# Altium schematic sheet QSPI_EMMC_MICROSD.SchDoc
size A3
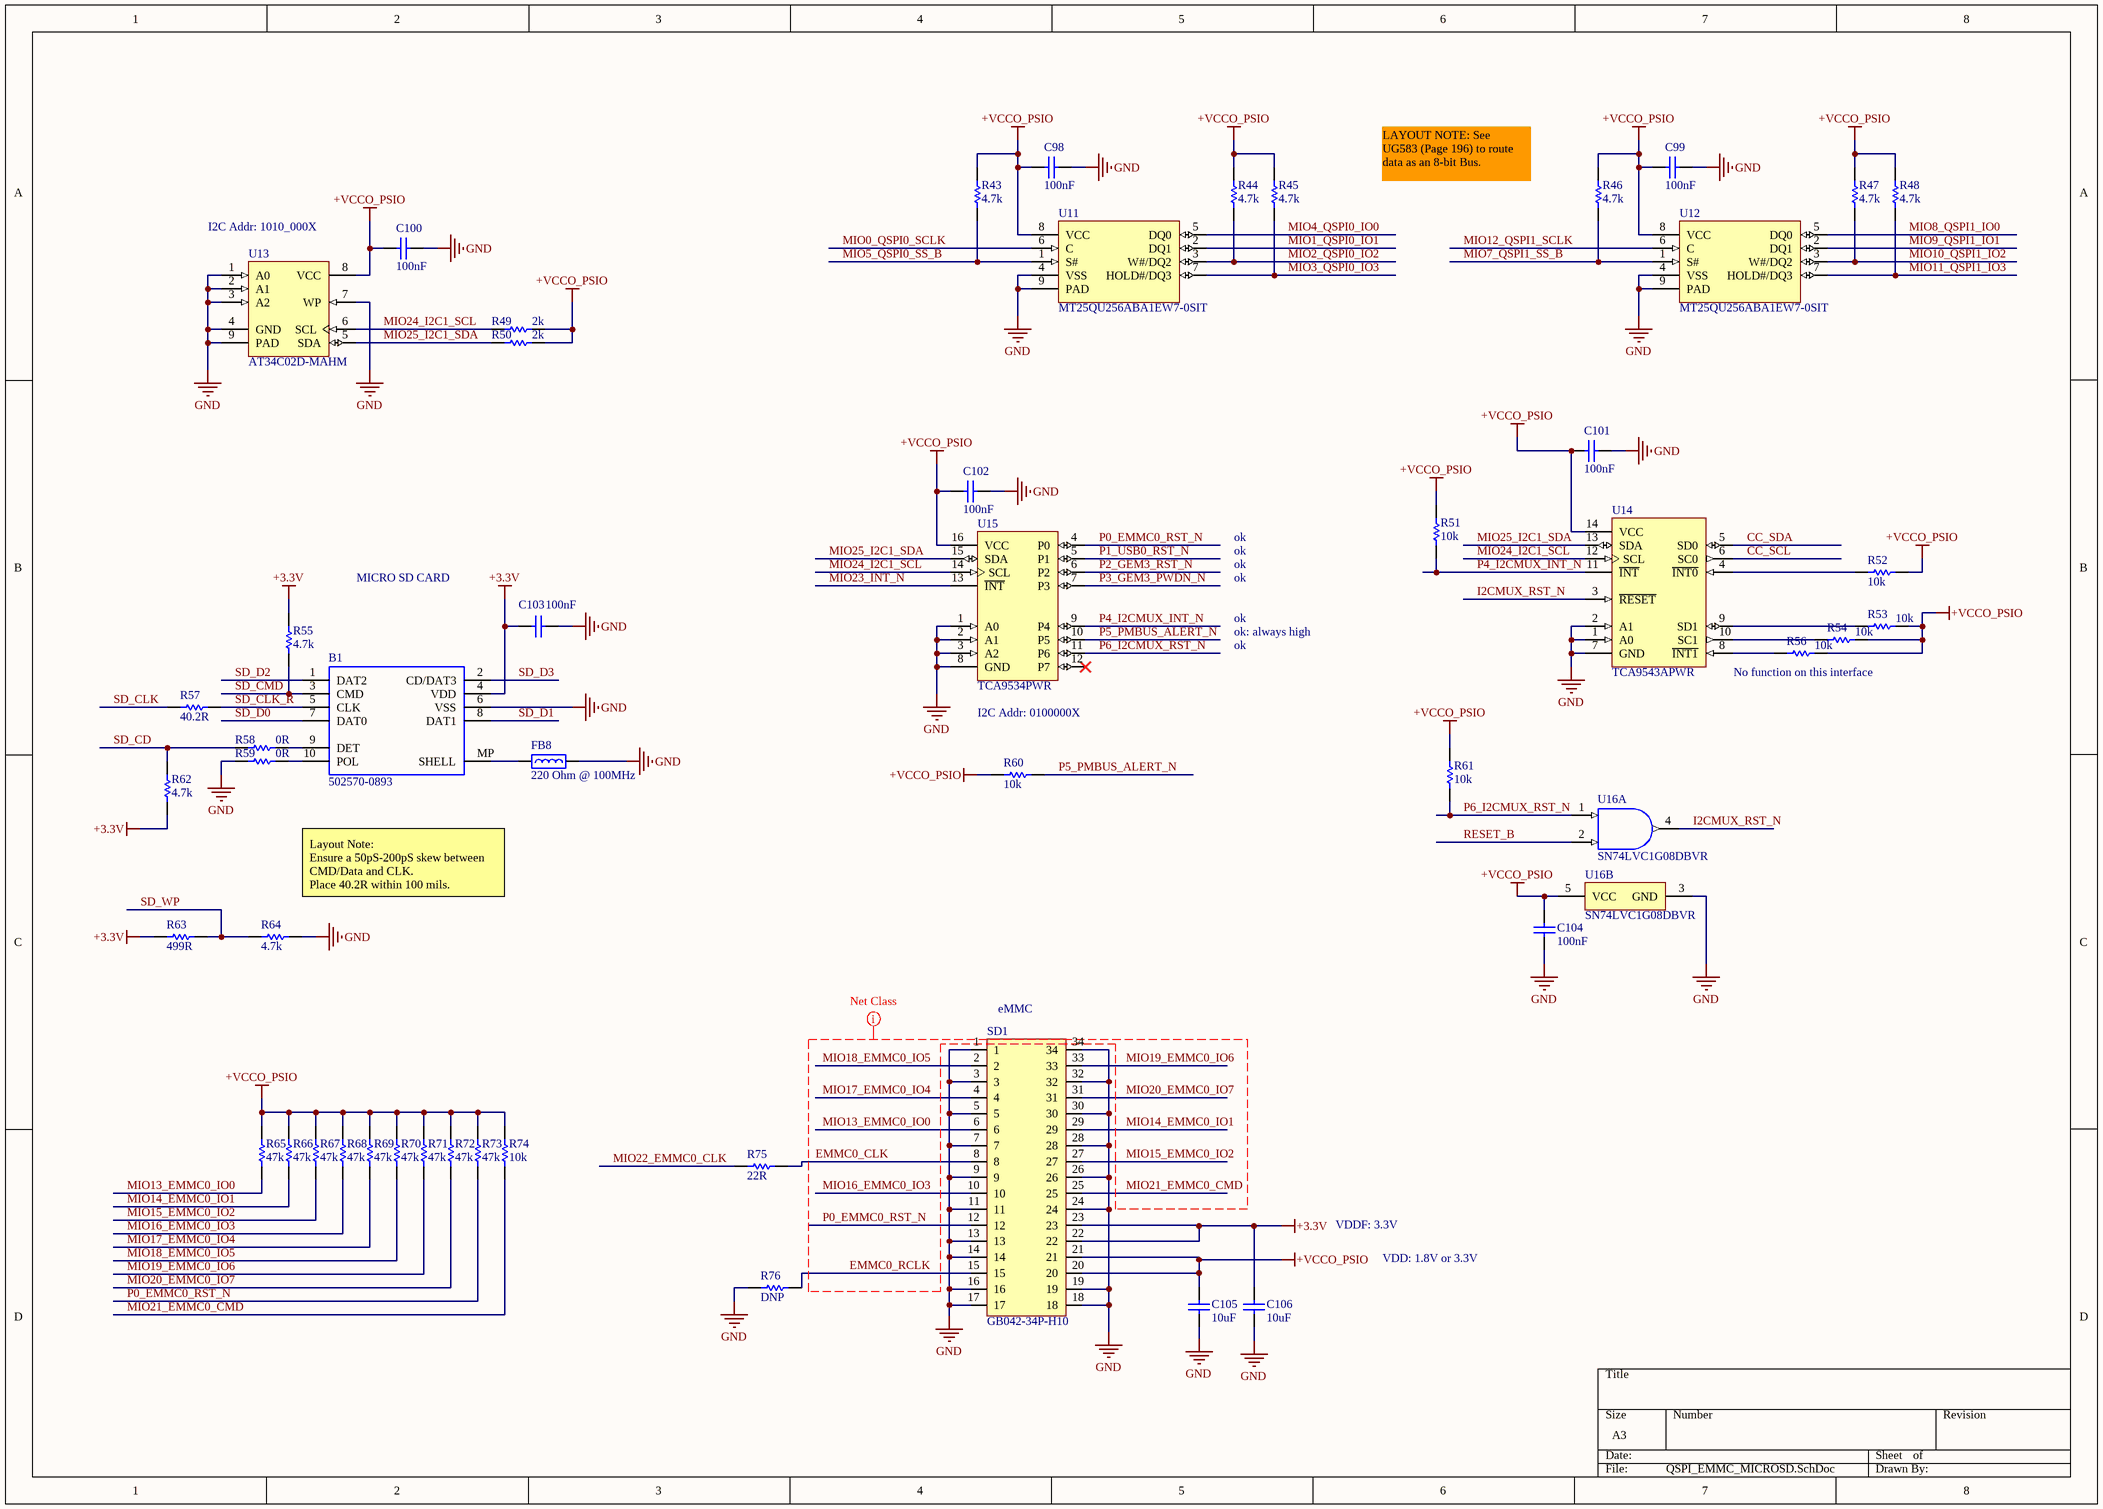
[diagram p0: QSPI_EMMC_MICROSD.SchDoc]

## Parts
B1  502570-0893  [502570-0893_1]
C98  100nF  [CAPC1005L_0402]
C99  100nF  [CAPC1005L_0402]
C100  100nF  [CAPC1005L_0402]
C101  100nF  [CAPC1005L_0402]
C102  100nF  [CAPC1005L_0402]
C103  100nF  [CAPC1005L_0402]
C104  100nF  [CAPC1005L_0402]
C105  10uF  [CAPC1005L_0402]
C106  10uF  [CAPC1005L_0402]
FB8  Impedance @ Frequency: 220 Ohm @ 100MHz  [INDC1608N_0603]  (hidden comment: BEAD0603_220_2A5_40M)
R43  value 4.7k  [RESC1005L_0402]  (hidden comment: RES0402_4K7_0W1_1T)
R44  value 4.7k  [RESC1005L_0402]  (hidden comment: RES0402_4K7_0W1_1T)
R45  value 4.7k  [RESC1005L_0402]  (hidden comment: RES0402_4K7_0W1_1T)
R46  value 4.7k  [RESC1005L_0402]  (hidden comment: RES0402_4K7_0W1_1T)
R47  value 4.7k  [RESC1005L_0402]  (hidden comment: RES0402_4K7_0W1_1T)
R48  value 4.7k  [RESC1005L_0402]  (hidden comment: RES0402_4K7_0W1_1T)
R49  value 2k  [RESC1005L_0402]  (hidden comment: RES0402_2K_0W1_1T)
R50  value 2k  [RESC1005L_0402]  (hidden comment: RES0402_2K_0W1_1T)
R51  value 10k  [RESC1005L_0402]  (hidden comment: RES0402_10K_0W1_05T)
R52  value 10k  [RESC1005L_0402]  (hidden comment: RES0402_10K_0W1_05T)
R53  value 10k  [RESC1005L_0402]  (hidden comment: RES0402_10K_0W1_05T)
R54  value 10k  [RESC1005L_0402]  (hidden comment: RES0402_10K_0W1_05T)
R55  value 4.7k  [RESC1005L_0402]  (hidden comment: RES0402_4K7_0W1_1T)
R56  value 10k  [RESC1005L_0402]  (hidden comment: RES0402_10K_0W1_05T)
R57  value 40.2R  [RESC1005L_0402]  (hidden comment: RES0402_40R2_0W1_1T)
R58  value 0R  [RESC1005L_0402]  (hidden comment: RES0402_0R_0W1)
R59  value 0R  [RESC1005L_0402]  (hidden comment: RES0402_0R_0W1)
R60  value 10k  [RESC1005L_0402]  (hidden comment: RES0402_10K_0W1_05T)
R61  value 10k  [RESC1005L_0402]  (hidden comment: RES0402_10K_0W1_05T)
R62  value 4.7k  [RESC1005L_0402]  (hidden comment: RES0402_4K7_0W1_1T)
R63  value 499R  [RESC1005L_0402]  (hidden comment: RES0402_499R_0W1_1T)
R64  value 4.7k  [RESC1005L_0402]  (hidden comment: RES0402_4K7_0W1_1T)
R65  value 47k  [RESC1005L_0402]  (hidden comment: RES0402_47K_0W1)
R66  value 47k  [RESC1005L_0402]  (hidden comment: RES0402_47K_0W1)
R67  value 47k  [RESC1005L_0402]  (hidden comment: RES0402_47K_0W1)
R68  value 47k  [RESC1005L_0402]  (hidden comment: RES0402_47K_0W1)
R69  value 47k  [RESC1005L_0402]  (hidden comment: RES0402_47K_0W1)
R70  value 47k  [RESC1005L_0402]  (hidden comment: RES0402_47K_0W1)
R71  value 47k  [RESC1005L_0402]  (hidden comment: RES0402_47K_0W1)
R72  value 47k  [RESC1005L_0402]  (hidden comment: RES0402_47K_0W1)
R73  value 47k  [RESC1005L_0402]  (hidden comment: RES0402_47K_0W1)
R74  value 10k  [RESC1005L_0402]  (hidden comment: RES0402_10K_0W1_05T)
R75  value 22R  [RESC1005L_0402]  (hidden comment: RES0402_22R_0W1_1T)
R76  value DNP  [RESC1005L_0402]  (hidden comment: RES0402)
SD1  GB042-34P-H10  [GB042-34P-H10]
U11  MT25QU256ABA1EW7-0SIT  [W-PDFN-8_6x5mm]
U12  MT25QU256ABA1EW7-0SIT  [W-PDFN-8_6x5mm]
U13  AT34C02D-MAHM  [UDFN_9]
U14  TCA9543APWR  [TSOP_PW14_L]
U15  TCA9534PWR  [TSOP_PW16_L]
U16  SN74LVC1G08DBVR  [DBV0005A_N]  (parts A,B of 2)

## Nets
+3.3V: B1.4(VDD) C103.1 C106.2 R55.2 R62.2 R63.1 SD1.22 SD1.23
+VCCO_PSIO: C98.1 C99.1 C100.1 C101.2 C102.1 C104.1 C105.2 R43.1 R44.1 R45.1 R46.1 R47.1 R48.1 R49.2 R50.2 R51.1 R52.1 R53.1 R54.1 R56.1 R60.1 R61.2 R65.2 R66.2 R67.2 R68.2 R69.2 R70.2 R71.2 R72.2 R73.2 R74.2 SD1.20 SD1.21 U11.8(VCC) U12.8(VCC) U13.8(VCC) U14.14(VCC) U15.16(VCC) U16.5(VCC)
GND: B1.6(VSS) C98.2 C99.2 C100.2 C101.1 C102.2 C103.2 C104.2 C105.1 C106.1 FB8.2 R59.2 R64.1 R76.1 SD1.1 SD1.3 SD1.5 SD1.7 SD1.9 SD1.11 SD1.13 SD1.14 SD1.16 SD1.17 SD1.18 SD1.19 SD1.24 SD1.26 SD1.28 SD1.30 SD1.32 SD1.34 U11.4(VSS) U11.9(PAD) U12.4(VSS) U12.9(PAD) U13.1(A0) U13.2(A1) U13.3(A2) U13.4(GND) U13.7(WP) U13.9(PAD) U14.1(A0) U14.2(A1) U14.7(GND) U15.1(A0) U15.2(A1) U15.3(A2) U15.8(GND) U16.3(GND)
CC_SCL: U14.6(SC0)
CC_SDA: U14.5(SD0)
EMMC0_CLK: R75.2 SD1.8
EMMC0_RCLK: R76.2 SD1.15
I2CMUX_RST_N: U14.3(~{RESET}) U16.4(Y)
MIO0_QSPI0_SCLK: U11.6(C)
MIO1_QSPI0_IO1: U11.2(DQ1)
MIO2_QSPI0_IO2: R44.2 U11.3(W#/DQ2)
MIO3_QSPI0_IO3: R45.2 U11.7(HOLD#/DQ3)
MIO4_QSPI0_IO0: U11.5(DQ0)
MIO5_QSPI0_SS_B: R43.2 U11.1(S#)
MIO7_QSPI1_SS_B: R46.2 U12.1(S#)
MIO8_QSPI1_IO0: U12.5(DQ0)
MIO9_QSPI1_IO1: U12.2(DQ1)
MIO10_QSPI1_IO2: R47.2 U12.3(W#/DQ2)
MIO11_QSPI1_IO3: R48.2 U12.7(HOLD#/DQ3)
MIO12_QSPI1_SCLK: U12.6(C)
MIO13_EMMC0_IO0: R65.1 SD1.6
MIO14_EMMC0_IO1: R66.1 SD1.29
MIO15_EMMC0_IO2: R67.1 SD1.27
MIO16_EMMC0_IO3: R68.1 SD1.10
MIO17_EMMC0_IO4: R69.1 SD1.4
MIO18_EMMC0_IO5: R70.1 SD1.2
MIO19_EMMC0_IO6: R71.1 SD1.33
MIO20_EMMC0_IO7: R72.1 SD1.31
MIO21_EMMC0_CMD: R74.1 SD1.25
MIO22_EMMC0_CLK: R75.1
MIO23_INT_N: U15.13(~{INT})
MIO24_I2C1_SCL: R49.1 U13.6(SCL) U14.12(SCL) U15.14(SCL)
MIO25_I2C1_SDA: R50.1 U13.5(SDA) U14.13(SDA) U15.15(SDA)
P0_EMMC0_RST_N: R73.1 SD1.12 U15.4(P0)
P1_USB0_RST_N: U15.5(P1)
P2_GEM3_RST_N: U15.6(P2)
P3_GEM3_PWDN_N: U15.7(P3)
P4_I2CMUX_INT_N: R51.2 U14.11(~{INT}) U15.9(P4)
P5_PMBUS_ALERT_N: R60.2 U15.10(P5)
P6_I2CMUX_RST_N: R61.1 U15.11(P6) U16.1(A)
RESET_B: U16.2(B)
SD_CD: R58.2 R62.1
SD_CLK: R57.1
SD_CLK_R: B1.5(CLK) R57.2
SD_CMD: B1.3(CMD) R55.1
SD_D0: B1.7(DAT0)
SD_D1: B1.8(DAT1)
SD_D2: B1.1(DAT2)
SD_D3: B1.2(CD/DAT3)
SD_WP: R63.2 R64.2
NetB1_9: B1.9(DET) R58.1
NetB1_10: B1.10(POL) R59.1
NetB1_MP: B1.MP(SHELL) FB8.1
NetR52_2: R52.2 U14.4(~{INT0})
NetR53_2: R53.2 U14.9(SD1)
NetR54_2: R54.2 U14.10(SC1)
NetR56_2: R56.2 U14.8(~{INT1})

Not connected (* = marked no-connect by the designer): U15 12(P7)*

## Layout directives
net class eMMC: EMMC0_CLK, EMMC0_RCLK, MIO13_EMMC0_IO0, MIO14_EMMC0_IO1, MIO15_EMMC0_IO2, MIO16_EMMC0_IO3, MIO17_EMMC0_IO4, MIO18_EMMC0_IO5, MIO19_EMMC0_IO6, MIO20_EMMC0_IO7, MIO21_EMMC0_CMD, P0_EMMC0_RST_N

## Notes on the sheet
- LAYOUT NOTE: See
  UG583 (Page 196) to route
  data as an 8-bit Bus.
- (near U13) I2C Addr: 1010_000X
- MICRO SD CARD
- ok
- ok: always high
- I2C Addr: 0100000X
- (near R56) No function on this interface
- Layout Note:
  Ensure a 50pS-200pS skew between
  CMD/Data and CLK.
  Place 40.2R within 100 mils.
- (near SD1) eMMC
- VDDF: 3.3V
- VDD: 1.8V or 3.3V

## Library data of the parts
B1 = SD 502570-0893: Micro SD card connector,SMT,push-push Micro SD card connector,SMT,push-push; Manufacturer_Name: Molex; Geometry.Height: mm; Detailed Description: 10 (8 + 2) Position Card Connector Secure Digital - microSD™ Surface Mount, Right Angle Gold; Card Type: Secure Digital - microSD™; Number of Positions: 10 (8 + 2); Connector Type: Connector and Ejector; Insertion, Removal Method: Push In, Push Out; Manufacturer_Part_Number: 502570-0893; Datasheet Link: http://www.molex.com/molex/products/datasheet.jsp?part=active/5025700893_MEMORY_CARD_SOCKET.xml; Digi-Key Part Number: WM19093CT-ND; Series: 502570; Mounting Type: Surface Mount, Right Angle; Features: Switch; Height Above Board: 0.071" (1.80mm); Mounting Feature: Normal, Standard - Top; Contact Finish: Gold; Contact Finish Thickness: 20µin (0.51µm); Supplier 1: Digi-Key; Supplier Part Number 1: WM19093CT-ND
C98-C104 = CAPCER0402X7R100N25V_10T: CAP CER 0.1UF 25V X7R 0402; Manufacturer 1: Murata Electronics North America; Manufacturer Part Number 1: GRM155R71E104KE14D; Tolerance: 10%; Package: 0402; ComponentLink1Description: Datasheet; Value: 100nF; Voltage: 25V; Temperature Coefficient: X7R; Supplier 1: Digi-Key; Supplier Part Number 1: 490-10698-1-ND; Operating Temperature: -55°C ~ 125°C
C105 C106 = CAPCER0402X5R10U10V_20T: CAP CER 10UF 10V X5R 0402; Manufacturer 1: Samsung Electro-Mechanics America, Inc.; Manufacturer Part Number 1: CL05A106MP5NUNC; Tolerance: 20%; Package: 0402; ComponentLink1Description: Datasheet; Value: 10uF; Voltage: 10V; Temperature Coefficient: X5R; Supplier 1: Digi-Key; Supplier Part Number 1: 1276-1450-1-ND; Operating Temperature: -55°C ~ 85°C
FB8 = BEAD0603_220_2A5_40M: FERRITE BEAD 220 OHM 0603 1LN; Manufacturer 1: Murata Electronics North America; Manufacturer Part Number 1: BLM18SG221TN1D; Current Rating (Max): 2.5A; DC Resistance (DCR) (Max): 40 mohm; Package: 0603; ComponentLink1Description: Datasheet; ComponentLink1URL: C:\Users\Public\Documents\Altium\AD16\Library\PDF\ENFA0003.pdf; Supplier 1: Digi-Key; Supplier Part Number 1: 490-5225-1-ND; Operating Temperature: -55°C ~ 125°C
R43-R48 R55 R62 R64 = RES0402_4K7_0W1_1T: RES SMD 4.7K OHM 1% 1/10W 0402; Manufacturer 1: Panasonic Electronic Components; Manufacturer Part Number 1: ERJ-2RKF4701X; Package: 0402; ComponentLink1Description: Datasheet; Power: 1/10W; Tolerance: 1%; Supplier 1: Digi-Key; Supplier Part Number 1: P4.70KLCT-ND
R49 R50 = RES0402_2K_0W1_1T: RES SMD 2K OHM 1% 1/16W 0402; Manufacturer 1: Vishay Dale; Manufacturer Part Number 1: CRCW04022K00FKED; Power: 1/10W; Package: 0402; ComponentLink1Description: Datasheet; Tolerance: 1%; Supplier 1: Digi-Key; Supplier Part Number 1: 541-2.00KLCT-ND
R51-R54 R56 R60 R61 R74 = RES0402_10K_0W1_05T: RES SMD 10K OHM 0.5% 1/16W 0402; Manufacturer 1: Panasonic Electronic Components; Manufacturer Part Number 1: ERJ-2RHD1002X; Package: 0402; ComponentLink1Description: Datasheet; Power: 1/16W; Tolerance: 0.5%; Supplier 1: Digi-Key; Supplier Part Number 1: P15984CT-ND
R57 = RES0402_40R2_0W1_1T: RES SMD 40.2 OHM 1% 1/10W 0402; Manufacturer 1: Panasonic Electronic Components; Manufacturer Part Number 1: ERJ-2RKF40R2X; Package: 0402; ComponentLink1Description: Datasheet; Power: 1/10W; Tolerance: 1%; Supplier 1: Digi-Key; Supplier Part Number 1: P40.2LCT-ND
R58 R59 = RES0402_0R_0W1: RES SMD 0 OHM JUMPER 1/10W 0402; Manufacturer 1: Panasonic Electronic Components; Manufacturer Part Number 1: ERJ-2GE0R00X; Package: 0402; ComponentLink1Description: Datasheet; Power: 1/10W; Tolerance: -; Supplier 1: Digi-Key; Supplier Part Number 1: P0.0JCT-ND
R63 = RES0402_499R_0W1_1T: RES SMD 499 OHM 1% 1/16W 0402; Manufacturer 1: Vishay Dale; Manufacturer Part Number 1: CRCW0402499RFKTD; Power: 1/10W; Package: 0402; ComponentLink1Description: Datasheet; Tolerance: 1%; Supplier 1: Digi-Key; Supplier Part Number 1: 541-2962-1-ND
R65-R73 = RES0402_47K_0W1: RES SMD 47K OHM 1% 1/10W 0402; Manufacturer 1: Panasonic Electronic Components; Manufacturer Part Number 1: ERJ-2RKF4702X; Package: 0402; ComponentLink1Description: Datasheet; Power: 1/10W; Tolerance: 1%; Supplier 1: Digi-Key; Supplier Part Number 1: P47.0KLCT-ND
R75 = RES0402_22R_0W1_1T: RES SMD 22 OHM 1% 1/10W 0402; Manufacturer 1: Panasonic Electronic Components; Manufacturer Part Number 1: ERJ-2RKF22R0X; Package: 0402; ComponentLink1Description: Datasheet; Power: 1/10W; Tolerance: 1%; Supplier 1: Digi-Key; Supplier Part Number 1: P22.0LCT-ND
R76 = RES0402: RES SMD 0402 Footprint; Package: 0402; ComponentLink1Description: Datasheet; Tolerance: -
SD1 = GB042-34P-H10: Connector, eMMC
U11 U12 = MT25QU256ABA1EW7-0SIT: IC FLASH 256MBIT 108MHZ 8VPDFN; Manufacturer 1: Micron Technology Inc.; ComponentLink1Description: Datasheet; ComponentLink1URL: C:\Users\Public\Documents\Altium\AD16\Library\PDF\MT25Q_QLJS_U_256_ABA_0.pdf; Supplier 1: Digi-Key; Manufacturer Part Number 1: MT25QU256ABA1EW7-0SIT
U13 = AT34C02D-MAHM: IC EEPROM 2KBIT 1MHZ 8UDFN; Manufacturer 1: Microchip Technology; Manufacturer Part Number 1: AT34C02D-MAHM-T; Code_JEDEC: MS-012-AA; Code_IPC: SOIC127P600-8; ComponentLink1Description: Datasheet; ComponentLink1URL: C:\Users\Public\Documents\Altium\AD16\Library\PDF\Atmel-8781-SEEPROM-AT34C02D-Datasheet.pdf; Supplier 1: Digikey; Supplier Part Number 1: AT34C02D-MAHM-TTR-ND; Operating Temperature: -40°C ~ 85°C (TA)
U14 = TCA9543APWR: IC I2C SW 2CH W/RESET 14TSSOP; Manufacturer 1: Texas Instruments; ComponentLink1Description: Datasheet; ComponentLink1URL: C:\Users\Public\Documents\Altium\AD16\Library\PDF\tca9543a.pdf; Supplier 1: Digi-Key; Supplier Part Number 1: 296-42157-1-ND; Manufacturer Part Number 1: TCA9543APWR; Operating Temperature: -40°C ~ 85°C
U15 = TCA9534PWR: IC I/O EXPANDER I2C 8B 16TSSOP; Manufacturer 1: Texas Instruments; ComponentLink1Description: Datasheet; ComponentLink1URL: C:\Users\Public\Documents\Altium\AD16\Library\PDF\tca9534.pdf; Supplier 1: Digi-Key; Supplier Part Number 1: 296-40574-1-ND; Manufacturer Part Number 1: TCA9534PWR; Operating Temperature: -40°C ~ 85°C
U16 = SN74LVC1G08DBVR: Single 2-Input Positive-AND Gate, DBV0005A, LARGE T&R; Manufacturer 1: Texas Instruments; VCC(Min)(V): 1.65; VCC(Max)(V): 5.5; Output Type: CMOS; ICC @ Nom Voltage(Max)(mA): 0.01; Input Type: CMOS/TTL; Bits(#): 1; F @ Nom Voltage(Max)(Mhz): 150; Rating: Catalog; Technology Family: LVC; Voltage(Nom)(V): 1.8,2.5,3.3,5; Schmitt Trigger: No; Output Drive (IOL/IOH)(Max)(mA): 32/-32; tpd @ Nom Voltage(Max)(ns): 4.5,6,4,5; Logic: True; Gate Type: AND; DatasheetVersion: SCES217Y; PackageReference: DBV0005A; Supplier 2: Mouser; Supplier Part Number 2: 595-SN74LVC1G08DBVR; Supplier 1: Digi-Key; Supplier Part Number 1: 296-11601-2-ND; Supplier 3: Digi-Key; Supplier Part Number 3: 296-11601-1-ND; Supplier 4: Digi-Key; Supplier Part Number 4: 296-11601-6-ND; Generic Part Number: SN74LVC1G08; Operating Temperature: -40°C ~ 125°C; Sub-Family: AND Gate; 3-State Output: No; Manufacturer Part Number 1: SN74LVC1G08DBVR; ComponentLink1Description: Manufacturer URL; ComponentLink1URL: C:\Users\Public\Documents\Altium\AD16\Library\PDF\sn74lvc1g08.pdf